# Altium schematic sheet memory.SchDoc
size A4; SheetNumber: 2; SheetTotal: 4
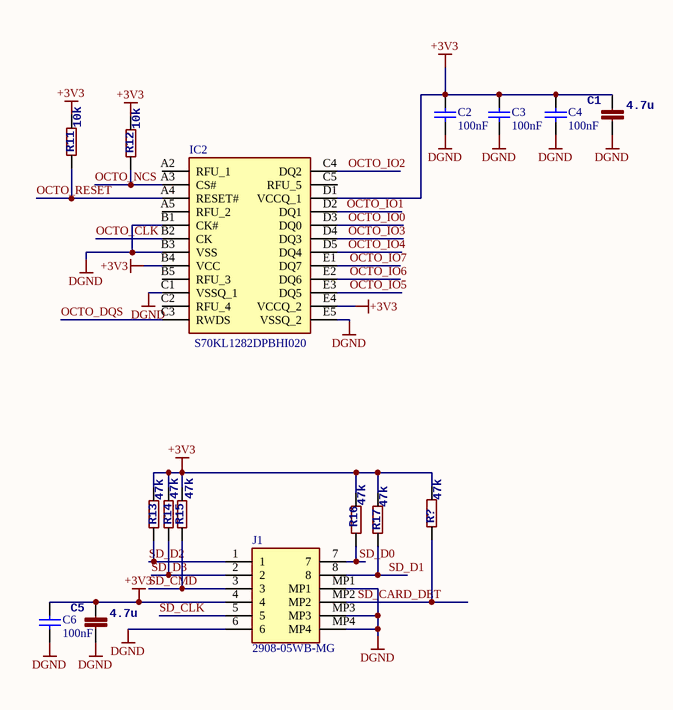
[diagram p0: memory.SchDoc]

## Parts
C1  4.7u  [C0805]
C2  value 100nF  [C0402]  (hidden comment: Capacitor)
C3  value 100nF  [C0402]  (hidden comment: Capacitor)
C4  value 100nF  [C0402]  (hidden comment: Capacitor)
C5  4.7u  [C0805]
C6  value 100nF  [C0402]  (hidden comment: Capacitor)
IC2  S70KL1282DPBHI020  [BGA24C100P5X5_600X800X100]
J1  2908-05WB-MG  [290805WBMG]
R11  10k  [R0805]
R12  10k  [R0805]
R13  47k  [R0805]
R14  47k  [R0805]
R15  47k  [R0805]
R16  47k  [R0805]
R17  47k  [R0805]
R?  47k  [R0805]

## Nets
+3V3: C1.1 C2.2 C3.2 C4.2 C5.1 C6.2 IC2.B4(VCC) IC2.D1(VCCQ_1) IC2.E4(VCCQ_2) J1.4 R11.2 R12.2 R13.2 R14.2 R15.2 R16.2 R17.2 R?.2
DGND: C1.2 C2.1 C3.1 C4.1 C5.2 C6.1 IC2.B1(CK#) IC2.B3(VSS) IC2.C1(VSSQ_1) IC2.E5(VSSQ_2) J1.6 J1.MP1 J1.MP3 J1.MP4
OCTO_CLK: IC2.B2(CK)
OCTO_DQS: IC2.C3(RWDS)
OCTO_IO0: IC2.D3(DQ0)
OCTO_IO1: IC2.D2(DQ1)
OCTO_IO2: IC2.C4(DQ2)
OCTO_IO3: IC2.D4(DQ3)
OCTO_IO4: IC2.D5(DQ4)
OCTO_IO5: IC2.E3(DQ5)
OCTO_IO6: IC2.E2(DQ6)
OCTO_IO7: IC2.E1(DQ7)
OCTO_NCS: IC2.A3(CS#) R12.1
OCTO_RESET: IC2.A4(RESET#) R11.1
SD_CARD_DET: J1.MP2 R?.1
SD_CLK: J1.5
SD_CMD: J1.3 R15.1
SD_D0: J1.7 R16.1
SD_D1: J1.8 R17.1
SD_D2: J1.1 R13.1
SD_D3: J1.2 R14.1

Not connected (* = marked no-connect by the designer): IC2 A2(RFU_1) A5(RFU_2) B5(RFU_3) C2(RFU_4) C5(RFU_5)

## Library data of the parts
C1 C5 = C-EUC0805: SPICEPREFIX: C
C2-C4 C6 = MCD-00102: Capacitor, MLCC, 100nF, 16V, X7R, 10%, 0402, T=0,5mm; Manufacturer_Part_Number: CC0402KRX7R7BB104; Manufacturer: YAGEO; Alternate_Manufacturer_Part_Number: GCM155R71C104KA55D; Alternate_Manufacturer: MURATA; ECCN_US: EAR99; ECCN_EU: NEC; Provided_By: SUBCO; Internal_Part_Number: MCD-00102; Status: Released; Part_Type: Capacitor; Package: C0402; ComponentLink1Description: Datasheet; ComponentLink1URL: http://tunmcdsvn.tun.st.com/Component_Datasheet_Library/Trunk/Capacitors/Yageo_Multilayer_Capacitor_X7R_series_100pF_to_22uF
IC2 = S70KL1282DPBHI020: Integrated Circuit; Manufacturer_Name: Infineon; Datasheet Link: https://www.cypress.com/file/501841/download; Height: 1mm; Manufacturer_Part_Number: S70KL1282DPBHI020; Mouser Part Number: 727-70KL1282DPBHI020; Mouser Price/Stock: https://www.mouser.co.uk/ProductDetail/Infineon-Technologies/S70KL1282DPBHI020?qs=DPoM0jnrROVgAEZ0o2TpIw%3D%3D
J1 = 2908-05WB-MG: Connector; Manufacturer_Name: 3M; Datasheet Link: https://componentsearchengine.com/Datasheets/1/2908-05WB-MG.pdf; Height: 1.85mm; Manufacturer_Part_Number: 2908-05WB-MG; Mouser Part Number: 517-2908-05WB-MG; Mouser Price/Stock: https://www.mouser.co.uk/ProductDetail/3M-Electronic-Solutions-Division/2908-05WB-MG?qs=vnwGVgFuQiZPJoOt79ALlw%3D%3D; Arrow Part Number: 2908-05WB-MG; Arrow Price/Stock: https://www.arrow.com/en/products/2908-05wb-mg/3m.html?utm_currency=USD&region=europe
R11-R17 R? = R-EU_R0805: <B>RESISTOR</B>, European symbol